# Altium schematic sheet CPU.SchDoc: OtterControl
size A4; Address4: Niklas Fauth; Revision: V1.0
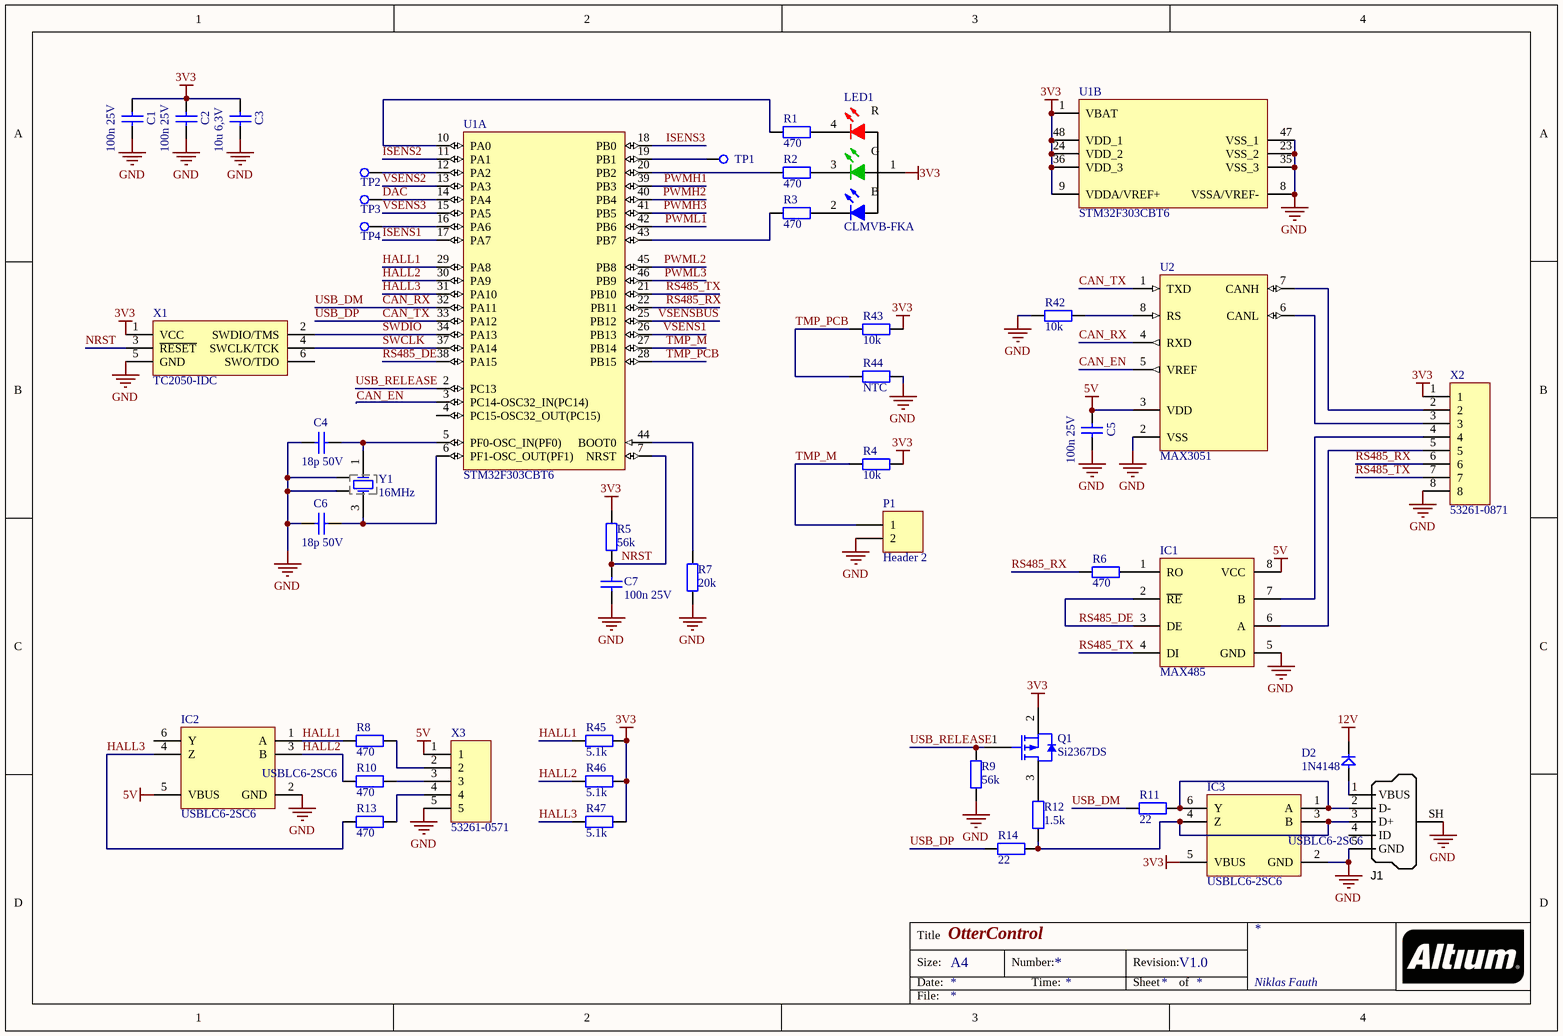
[diagram p0: CPU.SchDoc]

## Parts
C1  100n 25V  [C-0603-H]
C2  100n 25V  [C-0603-H]
C3  10u 6,3V  [C-0603-H]
C4  18p 50V  [C-0603-H]
C5  100n 25V  [C-0603-H]
C6  18p 50V  [C-0603-H]
C7  100n 25V  [C-0603-H]
D2  1N4148  [SOD323F]
IC1  MAX485  [SOIC-8]
IC2  USBLC6-2SC6  [SOT23-6]
IC3  USBLC6-2SC6  [SOT23-6]
J1  USB Micro Type B (recommended if hand soldering)  [USB_Micro-Molex]  (value not drawn)
LED1  CLMVB-FKA  [uLED]
P1  Header 2  [HDR1X2]
Q1  Si2367DS  [SOT-23]
R1  470  [R-0603-H]
R2  470  [R-0603-H]
R3  470  [R-0603-H]
R4  10k  [R-0603-H]
R5  56k  [R-0603-H]
R6  470  [R-0603-H]
R7  20k  [R-0603-H]
R8  470  [R-0603-H]
R9  56k  [R-0603-H]
R10  470  [R-0603-H]
R11  22  [R-0603-H]
R12  1.5k  [R-0603-H]
R13  470  [R-0603-H]
R14  22  [R-0603-H]
R42  10k  [R-0603-H]
R43  10k  [R-0603-H]
R44  NTC  [R-0603-H]
R45  5.1k  [R-0603-H]
R46  5.1k  [R-0603-H]
R47  5.1k  [R-0603-H]
TP1  TP-SMD  [TP]  (value not drawn)
TP2  TP-SMD  [TP]  (value not drawn)
TP3  TP-SMD  [TP]  (value not drawn)
TP4  TP-SMD  [TP]  (value not drawn)
U1  STM32F303CBT6  [STM-LQFP48_N]  (parts A,B of 2)
U2  MAX3051  [SOIC-SN8_N]
X1  TC2050-IDC  [TC2030-IDC-NL]
X2  53261-0871  [mlx-picoBlade-8p-right-SMD]
X3  53261-0571  [mlx-picoBlade-5p-right-SMD]
Y1  16MHz  [ABM10]

## Nets
3V3: C1.2 C2.2 C3.2 IC3.5(VBUS) LED1.1(A2) Q1.2 R4.2 R5.2 R43.2 R45.2 R46.2 R47.2 U1.1(VBAT) U1.9(VDDA/VREF+) U1.24(VDD_2) U1.36(VDD_3) U1.48(VDD_1) X1.1(VCC) X2.1
5V: C5.2 IC1.8(VCC) IC2.5(VBUS) U2.3(VDD) X3.1
12V: D2.2(kt)
GND: C1.1 C2.1 C3.1 C4.2 C5.1 C6.2 C7.1 IC1.5(GND) IC2.2(GND) IC3.2(GND) J1.5(GND) J1.SH(Shell) P1.2 R7.1 R9.2 R42.1 R44.2 U1.8(VSSA/VREF-) U1.23(VSS_2) U1.35(VSS_3) U1.47(VSS_1) U2.2(VSS) X1.5(GND) X2.8 X3.5 Y1.2 Y1.4
CAN_EN: U1.3(PC14-OSC32_IN(PC14)) U2.5(VREF)
CAN_RX: R11.2 U1.32(PA11) U2.4(RXD)  [also labelled USB_DM]
CAN_TX: R14.2 U1.33(PA12) U2.1(TXD)  [also labelled USB_DP]
DAC: TP3.1 U1.14(PA4)
HALL1: IC2.1(A) R8.1 R45.1 U1.29(PA8)
HALL2: IC2.3(B) R10.1 R46.1 U1.30(PA9)
HALL3: IC2.4(Z) R13.1 R47.1 U1.31(PA10)
ISENS1: U1.17(PA7)
ISENS2: U1.11(PA1)
ISENS3: U1.18(PB0)
NRST: C7.2 R5.1 U1.7(NRST) X1.3(~{RESET})
PWMH1: U1.39(PB3)
PWMH2: U1.40(PB4)
PWMH3: U1.41(PB5)
PWML1: U1.42(PB6)
PWML2: U1.45(PB8)
PWML3: U1.46(PB9)
RS485_DE: IC1.2(~{RE}) IC1.3(DE) U1.38(PA15)
RS485_RX: R6.1 U1.22(PB11) X2.6
RS485_TX: IC1.4(DI) U1.21(PB10) X2.7
SWCLK: U1.37(PA14) X1.4(SWCLK/TCK)
SWDIO: U1.34(PA13) X1.2(SWDIO/TMS)
TMP_M: P1.1 R4.1 U1.27(PB14)
TMP_PCB: R43.1 R44.1 U1.28(PB15)
USB_RELEASE: Q1.1 R9.1 U1.2(PC13)
VSENS1: U1.26(PB13)
VSENS2: U1.13(PA3)
VSENS3: U1.15(PA5)
VSENSBUS: U1.25(PB12)
NetC4_1: C4.1 U1.5(PF0-OSC_IN(PF0)) Y1.1
NetC6_1: C6.1 U1.6(PF1-OSC_OUT(PF1)) Y1.3
NetD2_1: D2.1(an) J1.1(VBUS)
NetIC1_1: IC1.1(RO) R6.2
NetIC1_6: IC1.6(A) X2.5
NetIC1_7: IC1.7(B) X2.4
NetIC3_1: IC3.1(A) IC3.6(Y) J1.2(D-) R11.1
NetIC3_3: IC3.3(B) IC3.4(Z) J1.3(D+) R12.1 R14.1
NetLED1_2: LED1.2(B) R3.1
NetLED1_3: LED1.3(G) R2.1
NetLED1_4: LED1.4(R) R1.1
NetQ1_3: Q1.3 R12.2
NetR1_2: R1.2 U1.10(PA0)
NetR2_2: R2.2 U1.20(PB2)
NetR3_2: R3.2 U1.43(PB7)
NetR7_2: R7.2 U1.44(BOOT0)
NetR8_2: R8.2 X3.2
NetR10_2: R10.2 X3.3
NetR13_2: R13.2 X3.4
NetR42_2: R42.2 U2.8(RS)
NetTP1_1: TP1.1 U1.19(PB1)
NetTP2_1: TP2.1 U1.12(PA2)
NetTP4_1: TP4.1 U1.16(PA6)
NetU2_6: U2.6(CANL) X2.3
NetU2_7: U2.7(CANH) X2.2

Not connected (* = marked no-connect by the designer): IC2 6(Y); J1 4(ID); U1 4(PC15-OSC32_OUT(PC15)); X1 6(SWO/TDO)

## Notes on the sheet
- Title
- Size:
- Date:
- A4
- Number:
- Time:
- Revision:
- Sheet
- of
- File:

## Library data of the parts
C1 C2 C5 C7 = C-0603-100n-25V: Capacitor 100n 25V; Supplier 1: Mouser; Supplier Part Number 1: 80-C0603C104K3R
C3 = C-0603-10u-6,3V: Capacitor 10uF 6,3V; Supplier 1: Mouser; Supplier Part Number 1: 80-C0603C106M9P
C4 C6 = C-0402-18p-50V: Capacitor 18p 50V; Supplier 1: Mouser; Supplier Part Number 1: 80-C0402C180J5G
D2 = 1N4148: Diode 1N4148; Supplier 1: Mouser; Supplier Part Number 1: 512-1N4148WS
IC1 = MAX485: RS485 transceiver
IC2 IC3 = USBLC6-2SC6: USB protection
J1 = USB_Micro_MOLEX: Connector SMD-THD USB Micro Type B middle mount
LED1 = uLED-RGB: CLMVB-FKA RGB; Supplier 1: Mouser; Supplier Part Number 1: 941-CLMVBFKACFHEHLCB
P1 = Header 2: Header, 2-Pin; LatestRevisionDate: 17-Jul-2002; LatestRevisionNote: Re-released for DXP Platform.; Publisher: Altium Limited
Q1 = MOSFET-P: Supplier 1: Mouser; Supplier Part Number 1: 781-SI2367DS-GE3
R1-R3 R6 R8 R10 R13 = R-0402-470: Resistor 470; Supplier 1: Mouser; Supplier Part Number 1: 71-CRCW0402-470-E3
R4 R42-R44 = R-0603-10k: Resistor 10k; Supplier 1: Mouser; Supplier Part Number 1: 71-CRCW0603-10K-E3
R5 R9 = R-0603-47k: Resistor 4k7; Supplier 1: Mouser; Supplier Part Number 1: 71-CRCW060347K0FKEB
R7 = R-0603-20k: Resistor 20k; Resistance: 20k; Supplier 1: Mouser; Supplier Part Number 1: 71-CRCW0603-20K-E3
R11 R14 = R-0603-22: Resistor 22; Supplier 1: Mouser; Supplier Part Number 1: 71-CRCW0603-22-E3
R12 = R-0603-1k5: Resistor 1.5k; Supplier 1: Mouser; Supplier Part Number 1: 71-CRCW0603-1.5K-E3
R45-R47 = R-0603-5k1: Resistor 5.1k; Supplier 1: Mouser; Supplier Part Number 1: 71-CRCW0603-5.1K-E3
U1 = CMP-0572-00014-2: ARM Cortex-M4 32-bit MCU, 128 KB Flash, 32 KB Internal RAM, 37 I/Os, 48-pin LQFP, -40 to 85 degC, Tray; Internal RAM Size (kB): 32; Supply Voltage(Vcc) min (V): 2; Operating Frequency(F) (Processor speed) (MHz): 72; FLASH Size (Prog) (kB): 128; I/Os (High Current): 37; D/A Converter: 2x12-bit (2 Channel); PackageDescription: 48-Pin Low Profile Quad Flat Package, 7 x 7 mm Body, 0.5 mm Pitch; ComponentLink1URL: http://www.st.com/web/en/home.html; Packing: Tray; ComponentLink1Description: Manufacturer URL; DatasheetVersion: Rev. 6; Mounting Technology: Surface Mount; PartNumber: STM32F303CBT6; Core: ARM Cortex-M4; ComponentLink2URL: http://www.st.com/st-web-ui/static/active/en/resource/technical/document/datasheet/DM00058181.pdf; ComponentLink3URL: http://www.st.com/st-web-ui/static/active/en/resource/technical/document/datasheet/DM00058181.pdf; PackageReference: LQFP48; ComponentLink3Description: Package Specification; PackageVersion: Rev. 6, 06/2013; ComponentLink2Description: Datasheet; PartId: 1
U2 = CMP-0186-00138-2: High-Speed CAN Transceiver, 8-Pin SOIC, Industrial Temperature; Code_JEDEC: MS-012; ComponentLink3URL: http://www.microchip.com/stellent/groups/techpub_sg/documents/packagingspec/en012702.pdf; DatasheetVersion: revF, Jul-2010; PackageVersion: revBB, Aug-2009; PackageDescription: 8-Lead Plastic Small Outline (SN) - Narrow, 3.90mm Body [SOIC]; ComponentLink1URL: http://www.microchip.com/; ComponentLink3Description: Package Specification; ComponentLink2Description: Datasheet; Code_IPC: SOIC127P600-8; ComponentLink1Description: Manufacturer URL; PackageReference: SOIC-SN8; ComponentLink2URL: http://ww1.microchip.com/downloads/en/DeviceDoc/21667F.pdf; RevisionNote: URLs added. DatasheetVersion updated.
X1 = TAG-Connect-SWD: TC2050-IDC SWD
X2 = MLX-picoBlade-8P-right-SMD: Supplier 1: Mouser; Supplier Part Number 1: 538-53261-0871
X3 = MLX-picoBlade-5P-right-SMD: Supplier 1: Mouser; Supplier Part Number 1: 538-53261-0571
Y1 = ABM10-16MHz: Supplier 1: Mouser; Supplier Part Number 1: 815-ABM10-16-D30T3